# EasyEDA schematic Sidekick Breakout V1.2 LDO.json
TITLE: Sheet_1; REV: 1.0; Date: 2024-03-24; Sheet: 1/1; Company: Your Company
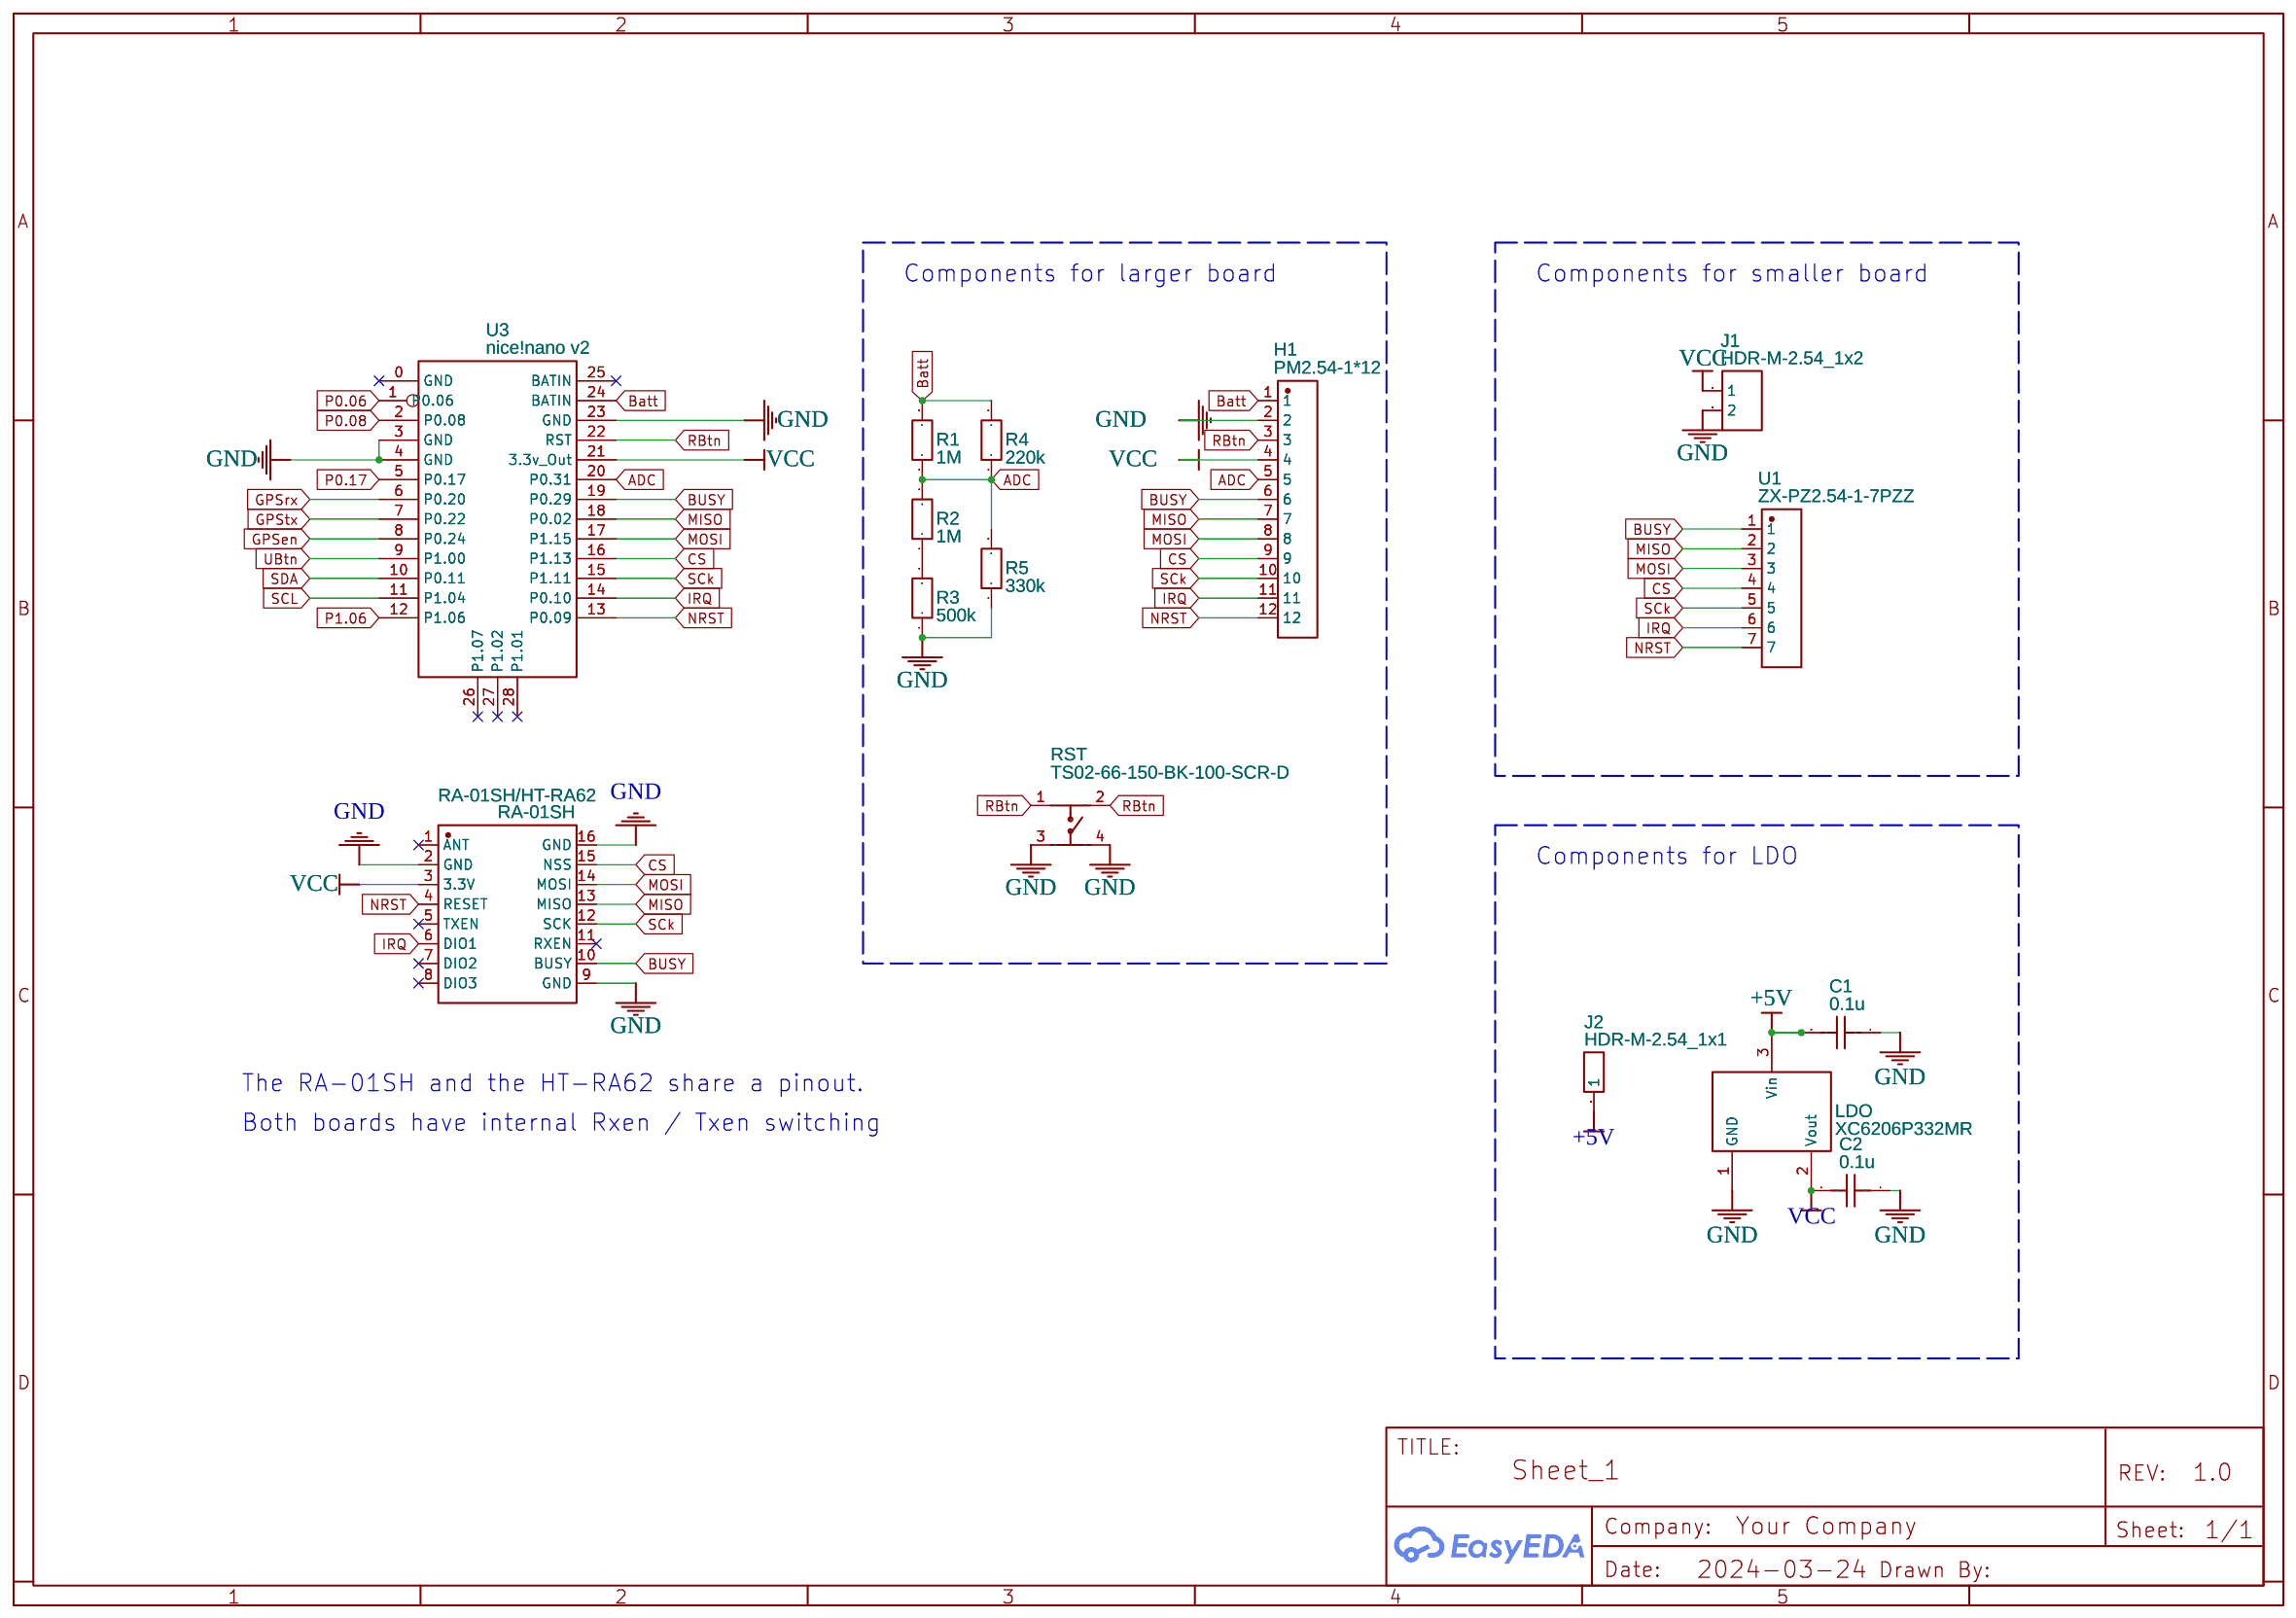
[diagram p0: schematic sheet]

## Parts
C1  0.1u  [C0805]
C2  0.1u  [C0805]
H1  PM2.54-1*12  [HDR-TH_12P-P2.54-V-F]
J1  HDR-M-2.54_1x2  [HDR-M-2.54_1X2]
J2  HDR-M-2.54_1x1  [HDR-M-2.54_1X1]
LDO  XC6206P332MR  [SOT-23-3_L2.9-W1.6-P1.90-LS2.8-BR]
R1  1M  [R1206]
R2  1M  [R1206]
R3  500k  [R1206]
R4  220k  [R_AXIAL-0.3]
R5  330k  [R_AXIAL-0.3]
RA-01SH/HT-RA62  RA-01SH  [WIRELM-SMD_RA-01SH]
RST  TS02-66-150-BK-100-SCR-D  [SW-TH_4P-L6.0-W6.0-P4.50-LS6.5]
U1  ZX-PZ2.54-1-7PZZ  [HDR-TH_7P-P2.54-V-M]
U3  nice!nano v2  [NICE!NANO V2_2]

## Library data of the parts
C1 C2 = C_0805_US: Contributor: LCEDA_Lib
H1 = PM2.54-1*12: Supplier: LCSC; Supplier Part: C5224029; Manufacturer: ZHOURI(洲日); JLCPCB Part Class: Extended Part; Contributor: lcsc
J1 = HDR-M-2.54_1x2: Supplier Part: C124375; Supplier: LCSC; Contributor: LCEDA_Lib
J2 = HDR-M-2.54_1x1: Supplier Part: C81276; Supplier: LCSC; Contributor: LCEDA_Lib
LDO = XC6206P332MR: Supplier: LCSC; Manufacturer: TOREX(特瑞仕); Manufacturer Part: XC6206P332MR-G; Supplier Part: C5446; JLCPCB Part Class: Basic Part
R1-R3 = R_1206_EU: Contributor: LCEDA_Lib
R4 R5 = R_AXIAL-0.3_EU: Contributor: LCEDA_Lib
RA-01SH/HT-RA62 = RA-01SH: Contributor: LCSC; Supplier: LCSC; Supplier Part: C2764087; Manufacturer: Ai-Thinker(安信可); Manufacturer Part: Ra-01SH; JLCPCB Part Class: Extended Part
RST = TS02-66-150-BK-100-SCR-D: Contributor: lcsc; Supplier: LCSC; Supplier Part: C4365133; Manufacturer: CUI
U1 = ZX-PZ2.54-1-7PZZ: Supplier: LCSC; Supplier Part: C7501265; Manufacturer: Megastar(兆星); Contributor: lcsc
U3 = nice!nano v2: Manufacturer: nice!; link: https://nicekeyboards.com/docs/nice-nano/pinout-schematic; Contributor: Filipe Silvestre

## Nets
+5V: C1.2 J2.1 LDO.3(Vin)
GND: C1.1 C2.1 H1.2 J1.2 LDO.1(GND) R3.1 R5.1 RA-01SH/HT-RA62.2(GND) RA-01SH/HT-RA62.9(GND) RA-01SH/HT-RA62.16(GND) RST.3 RST.4 U3.3(GND) U3.4(GND) U3.23(GND)
VCC: C2.2 H1.4 J1.1 LDO.2(Vout) RA-01SH/HT-RA62.3(3.3V) U3.21(3.3v Out)
ADC: H1.5 R1.1 R2.2 R4.1 R5.2 U3.20(P0.31)
Batt: H1.1 R1.2 R4.2 U3.24(BATIN)
BUSY: H1.6 RA-01SH/HT-RA62.10(BUSY) U1.1 U3.19(P0.29)
CS: H1.9 RA-01SH/HT-RA62.15(NSS) U1.4 U3.16(P1.13)
GPSen: U3.8(P0.24)
GPSrx: U3.6(P0.20)
GPStx: U3.7(P0.22)
IRQ: H1.11 RA-01SH/HT-RA62.6(DIO1) U1.6 U3.14(P0.10)
MISO: H1.7 RA-01SH/HT-RA62.13(MISO) U1.2 U3.18(P0.02)
MOSI: H1.8 RA-01SH/HT-RA62.14(MOSI) U1.3 U3.17(P1.15)
NRST: H1.12 RA-01SH/HT-RA62.4(RESET) U1.7 U3.13(P0.09)
P0.06: U3.1(P0.06)
P0.08: U3.2(P0.08)
P0.17: U3.5(P0.17)
P1.06: U3.12(P1.06)
RBtn: H1.3 RST.1 RST.2 U3.22(RST)
SCk: H1.10 RA-01SH/HT-RA62.12(SCK) U1.5 U3.15(P1.11)
SCL: U3.11(P1.04)
SDA: U3.10(P0.11)
UBtn: U3.9(P1.00)
Net-(R2-1): R2.1 R3.2

Not connected (* = marked no-connect by the designer): RA-01SH/HT-RA62 1(ANT)* 5(TXEN)* 7(DIO2)* 8(DIO3)* 11(RXEN)*; U3 0(GND)* 25(BATIN)* 26(P1.07)* 27(P1.02)* 28(P1.01)*

## Notes on the sheet
- Components for larger board
- Components for smaller board
- Components for LDO
- The RA-01SH and the HT-RA62 share a pinout.
- Both boards have internal Rxen / Txen switching
